# EAGLE schematic otterley_B_v1_2 (EAGLE 9.6.2)

## Sheet 1 of 6: Power
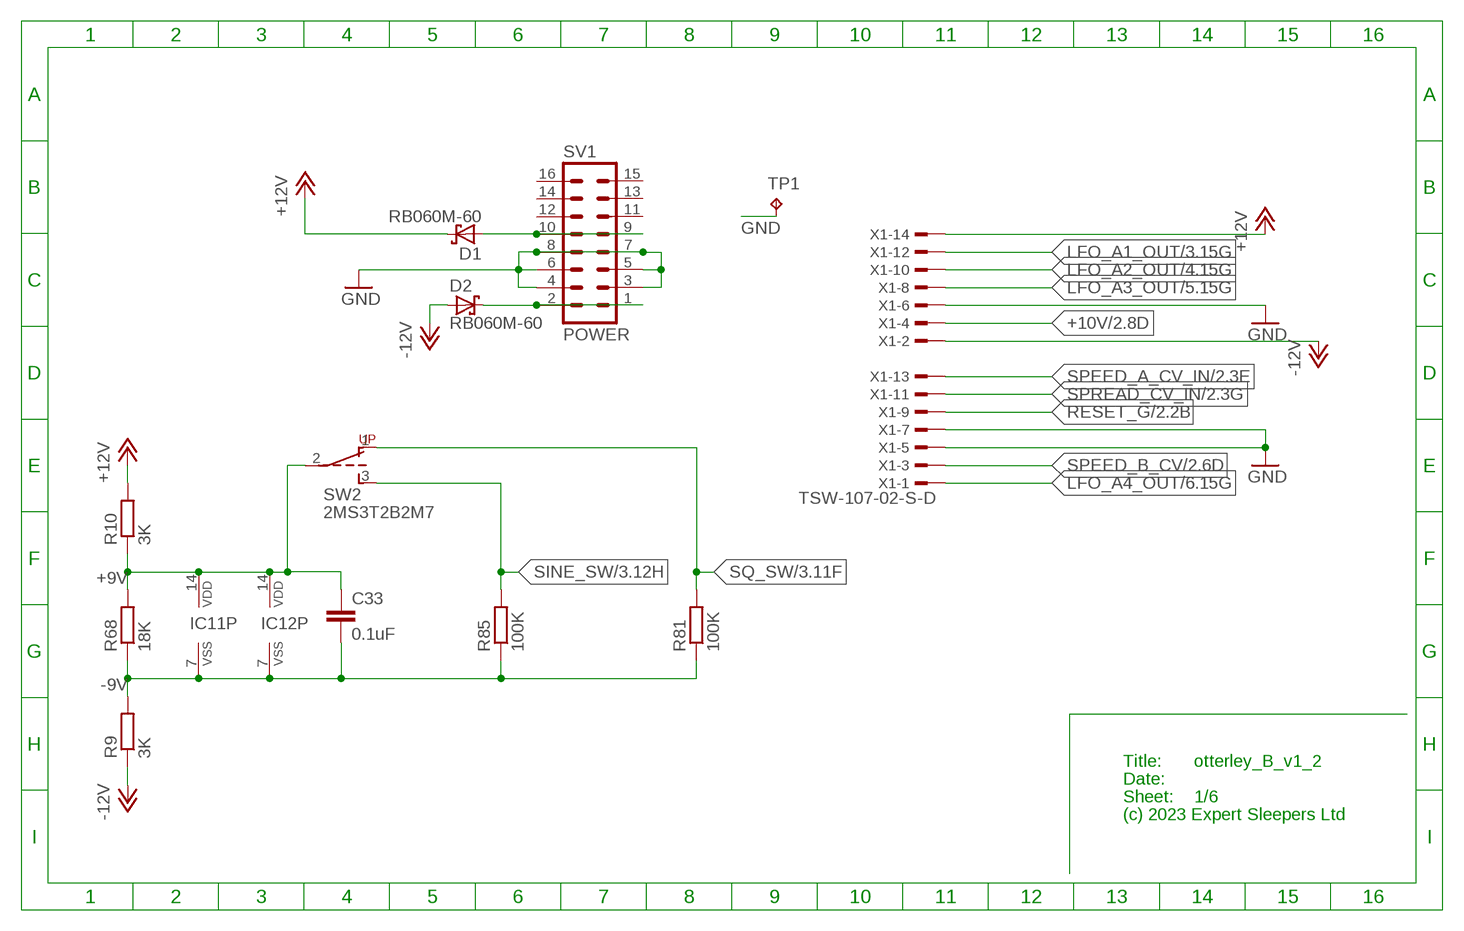
[diagram p0: schematic, sheet 1]

### Parts
C33  0.1uF  C-EUC0402  [C0402]
D1  RB060M-60  [SOD123FL]
D2  RB060M-60  [SOD123FL]
IC11  CD4066BPW  [PW_R-PDSO-G14]
IC12  CD4066BPW  [PW_R-PDSO-G14]
R9  3K  R-EU_R0603  [R0603]
R10  3K  R-EU_R0603  [R0603]
R68  18K  R-EU_R0603  [R0603]
R81  100K  R-EU_R0603  [R0603]
R85  100K  R-EU_R0603  [R0603]
SV1  POWER  ML16  [ML16]
SW2  2MS3T2B2M7  [2MS1T2B2M7RE]
TP1  RA2  TPPAD1-13  [P1-13]
X1  TSW-107-02-S-D  [TSW-107-02-S-D]

### Nets
+9V: C33.1 IC11.14(P:VDD) IC12.14(P:VDD) R10.1 R68.2 SW2.2(PR)
+10V: X1.4 ; also sheet 2,3,4,5,6
+12V: D1.C R10.2 X1.14 ; also sheet 2,3,4,5,6
-9V: C33.2 IC11.7(P:VSS) IC12.7(P:VSS) R9.2 R68.1 R81.1 R85.1
-12V: D2.A R9.1 X1.2 ; also sheet 2,3,4,5,6
GND [power]: SV1.3 SV1.4 SV1.5 SV1.6 SV1.7 SV1.8 TP1.TP X1.5 X1.6 X1.7 ; also sheet 2,3,4,5,6
LFO_A1_OUT: X1.12 ; also sheet 3
LFO_A2_OUT: X1.10 ; also sheet 4
LFO_A3_OUT: X1.8 ; also sheet 5
LFO_A4_OUT: X1.1 ; also sheet 6
N$1: D2.C SV1.1 SV1.2
N$15: D1.A SV1.9 SV1.10
RESET_G: X1.9 ; also sheet 2,3,4,5,6
SINE_SW: R85.2 SW2.3(RD) ; also sheet 3,4,5,6
SPEED_A_CV_IN: X1.13 ; also sheet 2
SPEED_B_CV: X1.3 ; also sheet 2
SPREAD_CV_IN: X1.11 ; also sheet 2
SQ_SW: R81.2 SW2.1(RU) ; also sheet 3,4,5,6
Unconnected: SV1.11 SV1.12 SV1.13 SV1.14 SV1.15 SV1.16

### Notes on the sheet
- Title:
- Date:
- Sheet:
- (c) 2023 Expert Sleepers Ltd

## Sheet 2 of 6: Controls
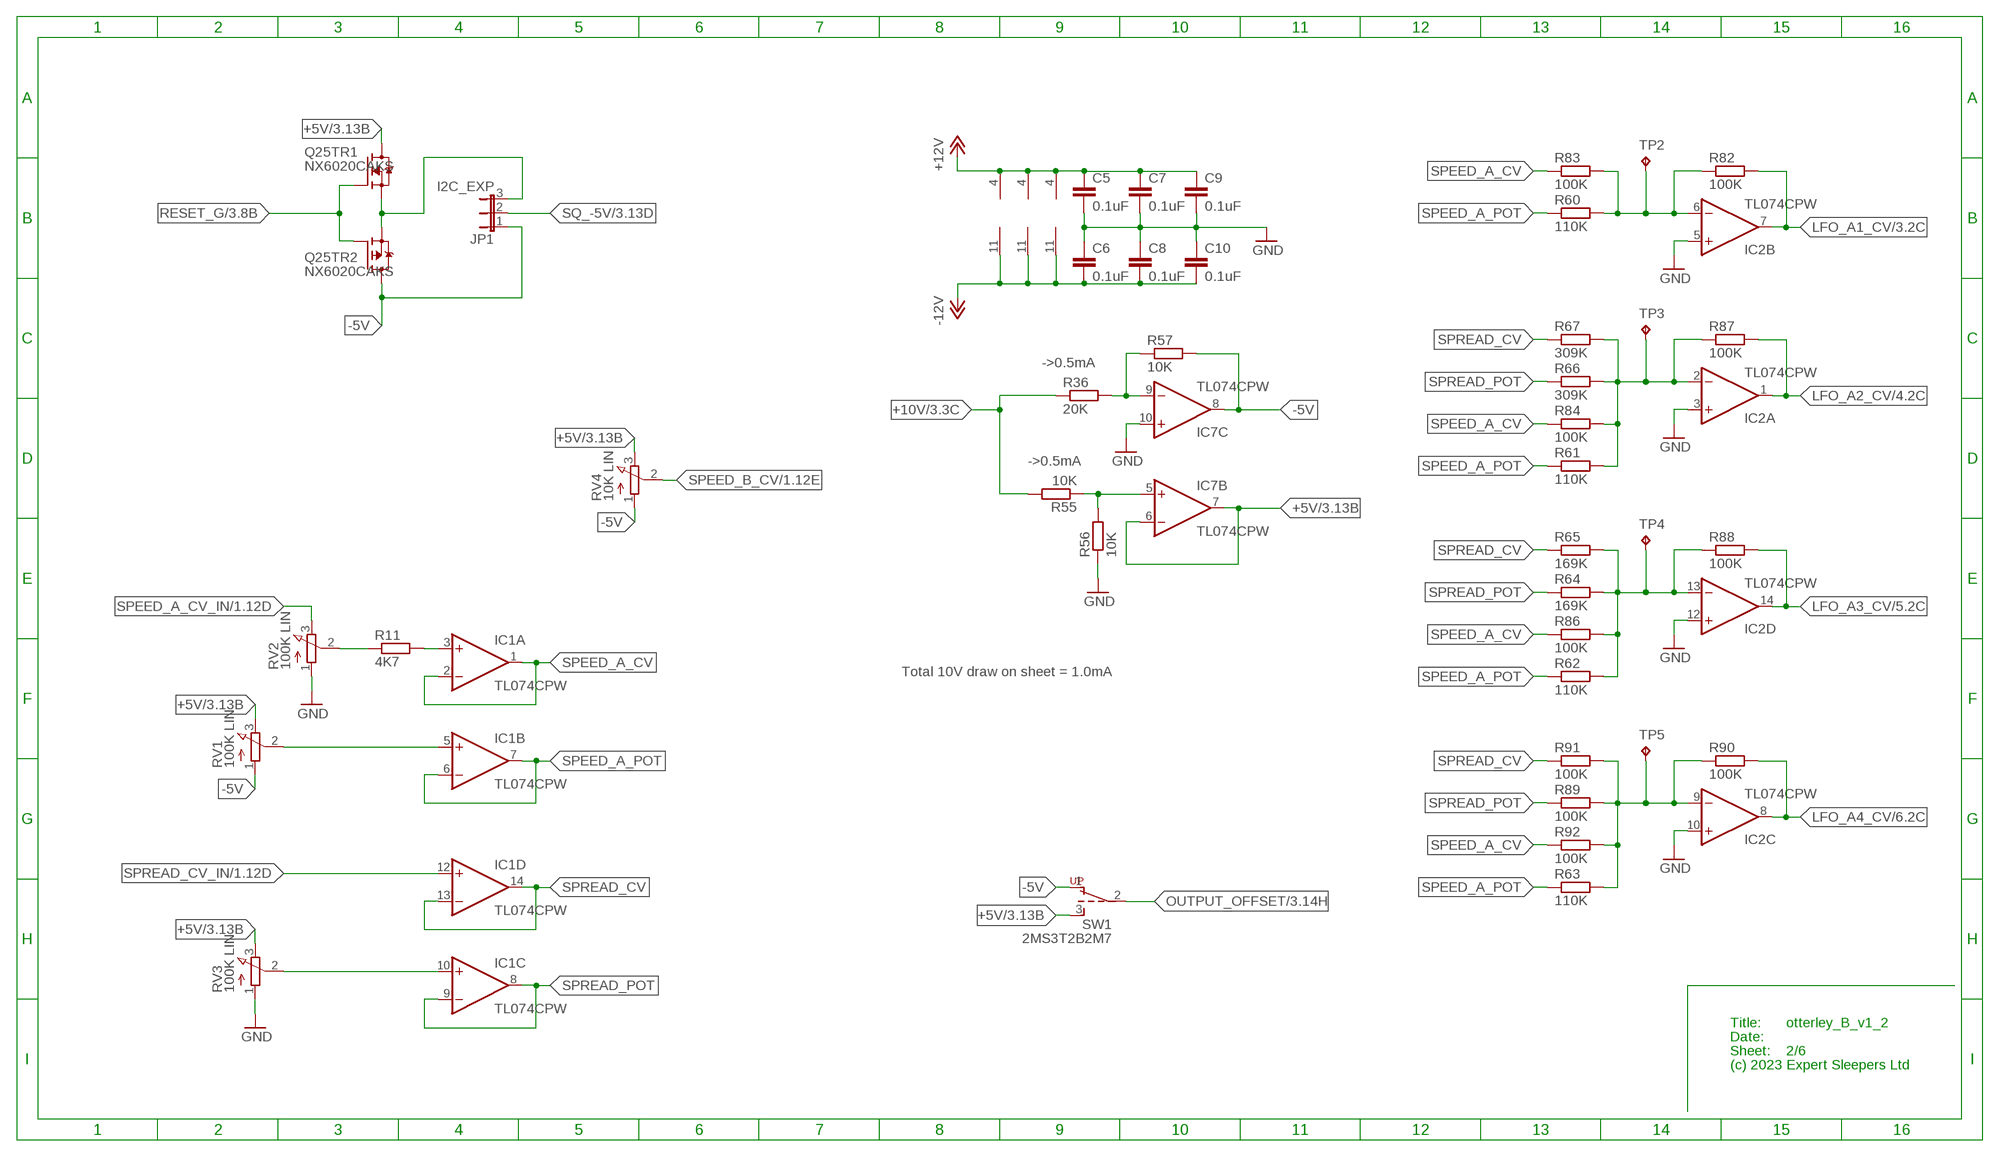
[diagram p1: schematic, sheet 2]

### Parts
C5  0.1uF  C-EUC0402  [C0402]
C6  0.1uF  C-EUC0402  [C0402]
C7  0.1uF  C-EUC0402  [C0402]
C8  0.1uF  C-EUC0402  [C0402]
C9  0.1uF  C-EUC0402  [C0402]
C10  0.1uF  C-EUC0402  [C0402]
IC1  TL074CPW  TL074PW  [PW_R-PDSO-G14]
IC2  TL074CPW  TL074PW  [PW_R-PDSO-G14]
IC7  TL074CPW  TL074PW  [PW_R-PDSO-G14]
JP1  I2C_EXP  JP2E  [JP2]
Q25  NX6020CAKS  [SOT363]
R11  4K7  R-EU_R0603  [R0603]
R36  20K  R-EU_R0603  [R0603]
R55  10K  R-EU_R0603  [R0603]
R56  10K  R-EU_R0603  [R0603]
R57  10K  R-EU_R0603  [R0603]
R60  110K  R-EU_R0603  [R0603]
R61  110K  R-EU_R0603  [R0603]
R62  110K  R-EU_R0603  [R0603]
R63  110K  R-EU_R0603  [R0603]
R64  169K  R-EU_R0603  [R0603]
R65  169K  R-EU_R0603  [R0603]
R66  309K  R-EU_R0603  [R0603]
R67  309K  R-EU_R0603  [R0603]
R82  100K  R-EU_R0603  [R0603]
R83  100K  R-EU_R0603  [R0603]
R84  100K  R-EU_R0603  [R0603]
R86  100K  R-EU_R0603  [R0603]
R87  100K  R-EU_R0603  [R0603]
R88  100K  R-EU_R0603  [R0603]
R89  100K  R-EU_R0603  [R0603]
R90  100K  R-EU_R0603  [R0603]
R91  100K  R-EU_R0603  [R0603]
R92  100K  R-EU_R0603  [R0603]
RV1  100K LIN  RD1610NOA0X  [RD1610NOA0X]
RV2  100K LIN  RD1610NOA0X  [RD1610NOA0X]
RV3  100K LIN  RD1610NOA0X  [RD1610NOA0X]
RV4  10K LIN  RD1610NOA0X  [RD1610NOA0X]
SW1  2MS3T2B2M7  [2MS1T2B2M7RE]
TP2  RA2  TPPAD1-13  [P1-13]
TP3  RA2  TPPAD1-13  [P1-13]
TP4  RA2  TPPAD1-13  [P1-13]
TP5  RA2  TPPAD1-13  [P1-13]

### Nets
+5V: IC7.6(B:-IN) IC7.7(B:OUT) Q25.6(TR1:D) RV1.3(E) RV3.3(E) RV4.3(E) SW1.3(RD) ; also sheet 3,4,5,6
+10V: R36.1 R55.2 ; also sheet 1,3,4,5,6
+12V: C5.1 C7.1 C9.1 IC1.4(P:V+) IC2.4(P:V+) IC7.4(P:V+) ; also sheet 1,3,4,5,6
-5V [power]: IC7.8(C:OUT) JP1.1 Q25.3(TR2:D) R57.2 RV1.1(A) RV4.1(A) SW1.1(RU)
-12V: C6.2 C8.2 C10.2 IC1.11(P:V-) IC2.11(P:V-) IC7.11(P:V-) ; also sheet 1,3,4,5,6
GND [power]: C5.2 C6.1 C7.2 C8.1 C9.2 C10.1 IC2.3(A:+IN) IC2.5(B:+IN) IC2.10(C:+IN) IC2.12(D:+IN) IC7.10(C:+IN) R56.1 RV2.1(A) RV3.1(A) ; also sheet 1,3,4,5,6
LFO_A1_CV: IC2.7(B:OUT) R82.2 ; also sheet 3
LFO_A2_CV: IC2.1(A:OUT) R87.2 ; also sheet 4
LFO_A3_CV: IC2.14(D:OUT) R88.2 ; also sheet 5
LFO_A4_CV: IC2.8(C:OUT) R90.2 ; also sheet 6
N$6: JP1.3 Q25.1(TR1:S) Q25.4(TR2:S)
N$7: IC1.5(B:+IN) RV1.2(S)
N$9: R11.1 RV2.2(S)
N$10: IC7.5(B:+IN) R55.1 R56.2
N$13: IC7.9(C:-IN) R36.2 R57.1
N$31: IC2.2(A:-IN) R61.2 R66.2 R67.2 R84.2 R87.1 TP3.TP
N$32: IC1.3(A:+IN) R11.2
N$52: IC2.6(B:-IN) R60.2 R82.1 R83.2 TP2.TP
N$57: IC1.10(C:+IN) RV3.2(S)
N$90: IC2.13(D:-IN) R62.2 R64.2 R65.2 R86.2 R88.1 TP4.TP
N$91: IC2.9(C:-IN) R63.2 R89.2 R90.1 R91.2 R92.2 TP5.TP
OUTPUT_OFFSET: SW1.2(PR) ; also sheet 3,4,5,6
RESET_G: Q25.2(TR1:G) Q25.5(TR2:G) ; also sheet 1,3,4,5,6
SPEED_A_CV: IC1.1(A:OUT) IC1.2(A:-IN) R83.1 R84.1 R86.1 R92.1
SPEED_A_CV_IN: RV2.3(E) ; also sheet 1
SPEED_A_POT: IC1.6(B:-IN) IC1.7(B:OUT) R60.1 R61.1 R62.1 R63.1
SPEED_B_CV: RV4.2(S) ; also sheet 1
SPREAD_CV: IC1.13(D:-IN) IC1.14(D:OUT) R65.1 R67.1 R91.1
SPREAD_CV_IN: IC1.12(D:+IN) ; also sheet 1
SPREAD_POT: IC1.8(C:OUT) IC1.9(C:-IN) R64.1 R66.1 R89.1
SQ_-5V: JP1.2 ; also sheet 3,4,5,6

### Notes on the sheet
- ->0.5mA
- ->0.5mA
- Total 10V draw on sheet = 1.0mA
- Title:
- Date:
- Sheet:
- (c) 2023 Expert Sleepers Ltd

## Sheet 3 of 6: LFO A1
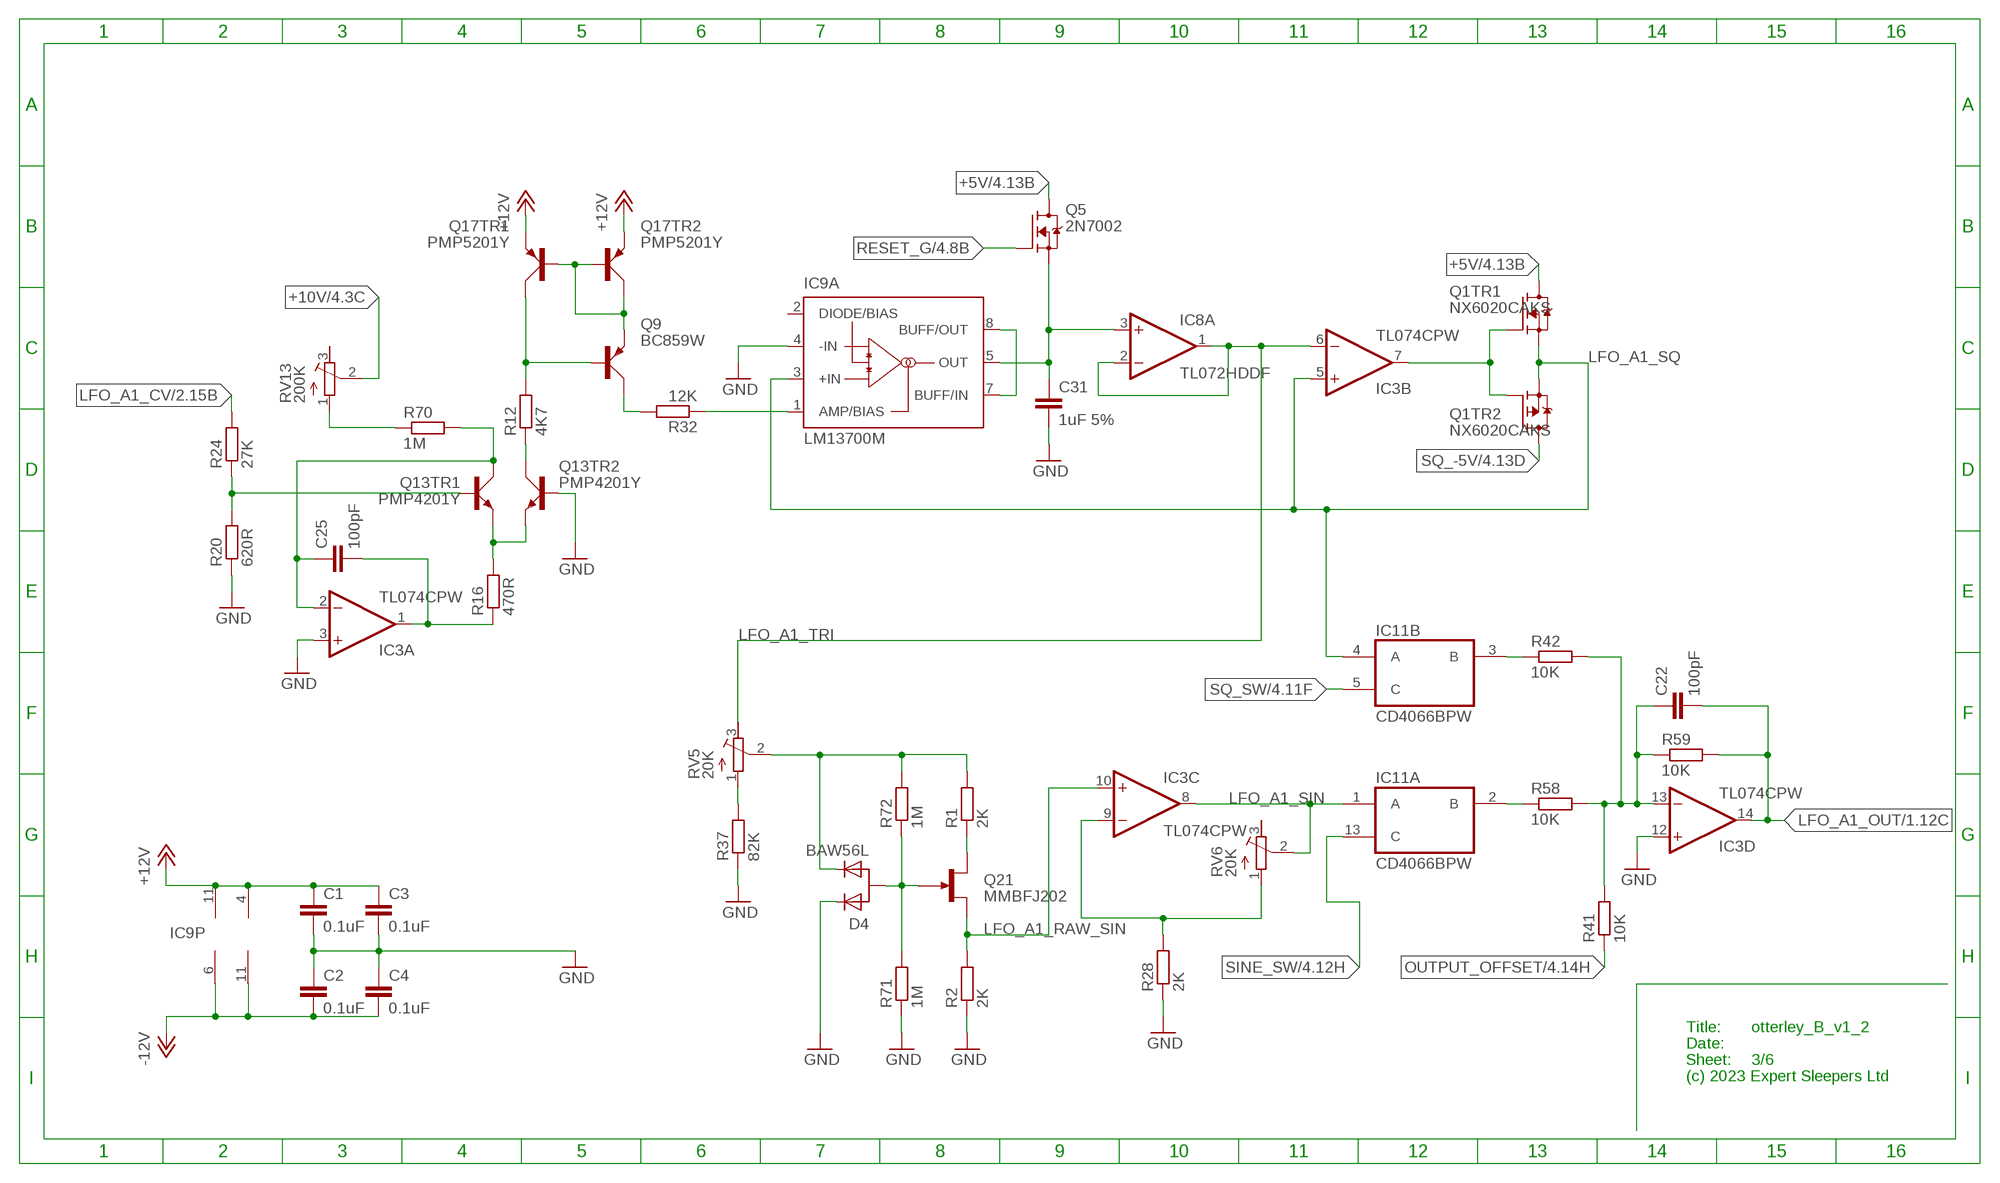
[diagram p2: schematic, sheet 3]

### Parts
C1  0.1uF  C-EUC0402  [C0402]
C2  0.1uF  C-EUC0402  [C0402]
C3  0.1uF  C-EUC0402  [C0402]
C4  0.1uF  C-EUC0402  [C0402]
C22  100pF  C-EUC0603  [C0603]
C25  100pF  C-EUC0603  [C0603]
C31  1uF 5%  C-EUC0805  [C0805]
D4  BAW56L  [SOT-23]
IC3  TL074CPW  TL074PW  [PW_R-PDSO-G14]
IC8  TL072HDDF  [DDF0008A]
IC9  LM13700M  [SO16]
Q1  NX6020CAKS  [SOT363]
Q5  2N7002  [SOT23]
Q9  BC859W  [SOT323]
Q13  PMP4201Y  [SOT65P210X110-6N]
Q17  PMP5201Y  [SOT65P210X110-6N]
Q21  MMBFJ202  MMBFJ3  [SOT23]
R1  2K  R-EU_R0603  [R0603]
R2  2K  R-EU_R0603  [R0603]
R12  4K7  R-EU_R0603  [R0603]
R16  470R  R-EU_R0603  [R0603]
R20  620R  R-EU_R0603  [R0603]
R24  27K  R-EU_R0603  [R0603]
R28  2K  R-EU_R0603  [R0603]
R32  12K  R-EU_R0603  [R0603]
R37  82K  R-EU_R0603  [R0603]
R41  10K  R-EU_R0603  [R0603]
R42  10K  R-EU_R0603  [R0603]
R58  10K  R-EU_R0603  [R0603]
R59  10K  R-EU_R0603  [R0603]
R70  1M  R-EU_R0603  [R0603]
R71  1M  R-EU_R0603  [R0603]
R72  1M  R-EU_R0603  [R0603]
RV5  20K  TC33X  [TC33X]
RV6  20K  TC33X  [TC33X]
RV13  200K  TC33X  [TC33X]

### Nets
+5V: Q1.6(TR1:D) Q5.3(D) ; also sheet 2,4,5,6
+10V: RV13.2(S) ; also sheet 1,2,4,5,6
+12V: C1.1 C3.1 IC3.4(P:V+) IC9.11(P:V+) Q17.4(TR2:E) Q17.5(TR1:E) ; also sheet 1,2,4,5,6
-12V: C2.2 C4.2 IC3.11(P:V-) IC9.6(P:V-) ; also sheet 1,2,4,5,6
GND [power]: C1.2 C2.1 C3.2 C4.1 C31.2 D4.1(C1) IC3.3(A:+IN) IC3.12(D:+IN) IC9.4(A:-IN) Q13.2(TR2:B) R2.1 R20.1 R28.1 R37.1 R71.1 ; also sheet 1,2,4,5,6
LFO_A1_CV: R24.2 ; also sheet 2
LFO_A1_OUT: C22.2 IC3.14(D:OUT) R59.2 ; also sheet 1
LFO_A1_RAW_SIN: IC3.10(C:+IN) Q21.2(S) R2.2
LFO_A1_SIN: IC3.8(C:OUT) IC11.1(A:A) RV6.2(S)
LFO_A1_SQ: IC3.5(B:+IN) IC9.3(A:+IN) IC11.4(B:A) Q1.1(TR1:S) Q1.4(TR2:S)
LFO_A1_TRI: IC3.6(B:-IN) IC8.1(A:OUT) IC8.2(A:-IN) RV5.3(E)
N$3: IC9.7(A:BUFF/IN) IC9.8(A:BUFF/OUT)
N$5: IC11.3(B:B) R42.1
N$14: C31.1 IC8.3(A:+IN) IC9.5(A:OUT) Q5.2(S)
N$24: IC9.1(A:AMP/BIAS) R32.1
N$26: C25.1 IC3.2(A:-IN) Q13.6(TR1:C) R70.2
N$27: C25.2 IC3.1(A:OUT) R16.1
N$28: Q13.4(TR2:E) Q13.5(TR1:E) R16.2
N$33: Q9.3(C) R32.2
N$34: Q13.3(TR2:C) R12.1
N$35: Q9.1(B) Q17.6(TR1:C) R12.2
N$36: Q9.2(E) Q17.1(TR1:B) Q17.2(TR2:B) Q17.3(TR2:C)
N$37: IC3.9(C:-IN) R28.2 RV6.1(A)
N$39: R37.2 RV5.1(A)
N$40: D4.2(C2) R1.2 R72.2 RV5.2(S)
N$42: D4.3(A) Q21.3(G) R71.2 R72.1
N$43: C22.1 IC3.13(D:-IN) R41.2 R42.2 R58.2 R59.1
N$44: Q21.1(D) R1.1
N$48: IC11.2(A:B) R58.1
N$49: R70.1 RV13.1(A)
N$51: Q13.1(TR1:B) R20.2 R24.1
N$53: IC3.7(B:OUT) Q1.2(TR1:G) Q1.5(TR2:G)
OUTPUT_OFFSET: R41.1 ; also sheet 2,4,5,6
RESET_G: Q5.1(G) ; also sheet 1,2,4,5,6
SINE_SW: IC11.13(A:C) ; also sheet 1,4,5,6
SQ_-5V: Q1.3(TR2:D) ; also sheet 2,4,5,6
SQ_SW: IC11.5(B:C) ; also sheet 1,4,5,6
Unconnected: IC9.2(A:DIODE/BIAS) RV6.3(E) RV13.3(E)

### Notes on the sheet
- Title:
- Date:
- Sheet:
- (c) 2023 Expert Sleepers Ltd

## Sheet 4 of 6: LFO A2
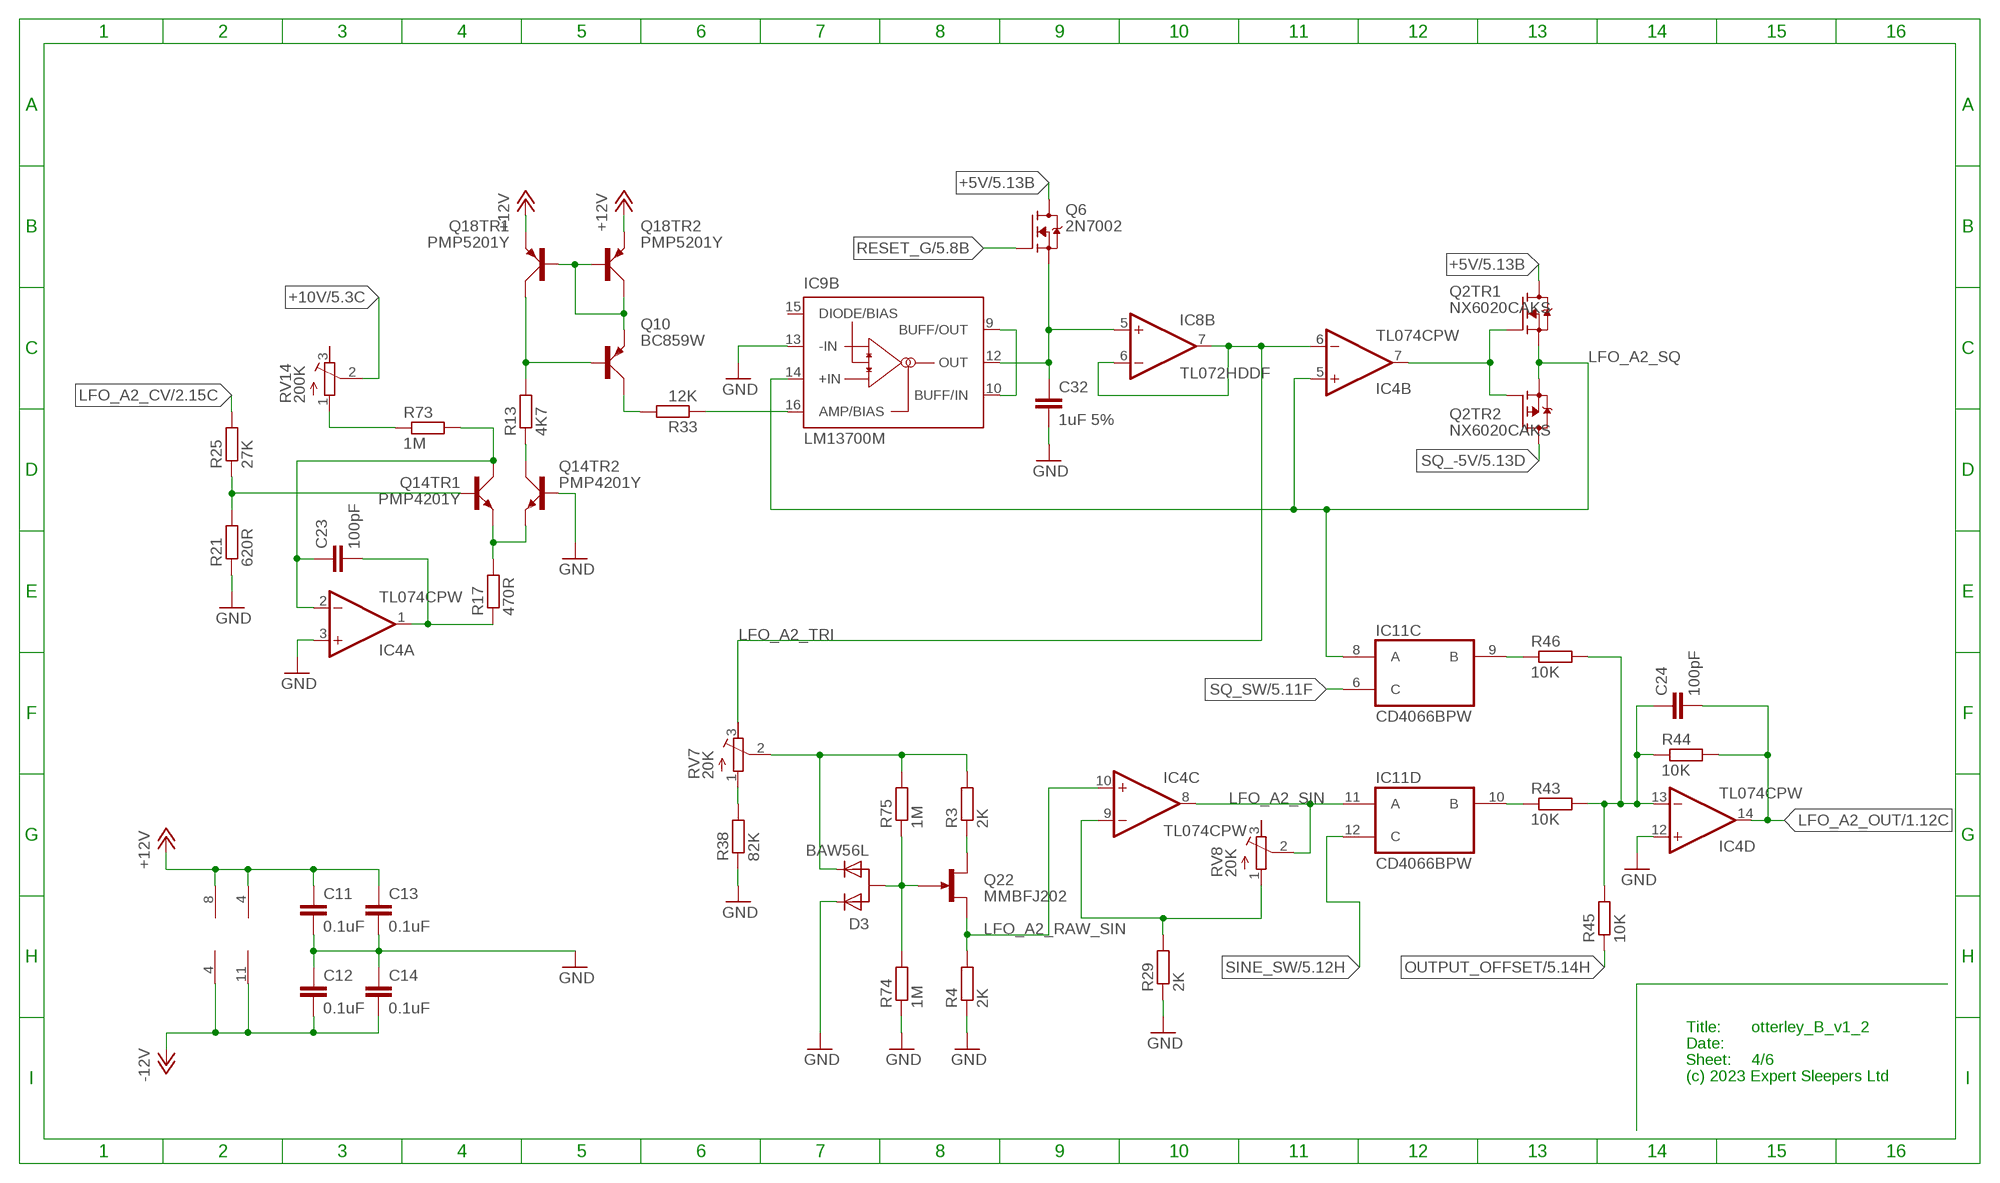
[diagram p3: schematic, sheet 4]

### Parts
C11  0.1uF  C-EUC0402  [C0402]
C12  0.1uF  C-EUC0402  [C0402]
C13  0.1uF  C-EUC0402  [C0402]
C14  0.1uF  C-EUC0402  [C0402]
C23  100pF  C-EUC0603  [C0603]
C24  100pF  C-EUC0603  [C0603]
C32  1uF 5%  C-EUC0805  [C0805]
D3  BAW56L  [SOT-23]
IC4  TL074CPW  TL074PW  [PW_R-PDSO-G14]
Q2  NX6020CAKS  [SOT363]
Q6  2N7002  [SOT23]
Q10  BC859W  [SOT323]
Q14  PMP4201Y  [SOT65P210X110-6N]
Q18  PMP5201Y  [SOT65P210X110-6N]
Q22  MMBFJ202  MMBFJ3  [SOT23]
R3  2K  R-EU_R0603  [R0603]
R4  2K  R-EU_R0603  [R0603]
R13  4K7  R-EU_R0603  [R0603]
R17  470R  R-EU_R0603  [R0603]
R21  620R  R-EU_R0603  [R0603]
R25  27K  R-EU_R0603  [R0603]
R29  2K  R-EU_R0603  [R0603]
R33  12K  R-EU_R0603  [R0603]
R38  82K  R-EU_R0603  [R0603]
R43  10K  R-EU_R0603  [R0603]
R44  10K  R-EU_R0603  [R0603]
R45  10K  R-EU_R0603  [R0603]
R46  10K  R-EU_R0603  [R0603]
R73  1M  R-EU_R0603  [R0603]
R74  1M  R-EU_R0603  [R0603]
R75  1M  R-EU_R0603  [R0603]
RV7  20K  TC33X  [TC33X]
RV8  20K  TC33X  [TC33X]
RV14  200K  TC33X  [TC33X]

### Nets
+5V: Q2.6(TR1:D) Q6.3(D) ; also sheet 2,3,5,6
+10V: RV14.2(S) ; also sheet 1,2,3,5,6
+12V: C11.1 C13.1 IC4.4(P:V+) IC8.8(P:V+) Q18.4(TR2:E) Q18.5(TR1:E) ; also sheet 1,2,3,5,6
-12V: C12.2 C14.2 IC4.11(P:V-) IC8.4(P:V-) ; also sheet 1,2,3,5,6
GND [power]: C11.2 C12.1 C13.2 C14.1 C32.2 D3.1(C1) IC4.3(A:+IN) IC4.12(D:+IN) IC9.13(B:-IN) Q14.2(TR2:B) R4.1 R21.1 R29.1 R38.1 R74.1 ; also sheet 1,2,3,5,6
LFO_A2_CV: R25.2 ; also sheet 2
LFO_A2_OUT: C24.2 IC4.14(D:OUT) R44.2 ; also sheet 1
LFO_A2_RAW_SIN: IC4.10(C:+IN) Q22.2(S) R4.2
LFO_A2_SIN: IC4.8(C:OUT) IC11.11(D:A) RV8.2(S)
LFO_A2_SQ: IC4.5(B:+IN) IC9.14(B:+IN) IC11.8(C:A) Q2.1(TR1:S) Q2.4(TR2:S)
LFO_A2_TRI: IC4.6(B:-IN) IC8.6(B:-IN) IC8.7(B:OUT) RV7.3(E)
N$8: IC11.9(C:B) R46.1
N$11: IC9.9(B:BUFF/OUT) IC9.10(B:BUFF/IN)
N$75: C32.1 IC8.5(B:+IN) IC9.12(B:OUT) Q6.2(S)
N$93: IC9.16(B:AMP/BIAS) R33.1
N$94: C23.1 IC4.2(A:-IN) Q14.6(TR1:C) R73.2
N$95: C23.2 IC4.1(A:OUT) R17.1
N$96: Q14.4(TR2:E) Q14.5(TR1:E) R17.2
N$97: Q10.3(C) R33.2
N$98: Q10.1(B) Q18.6(TR1:C) R13.2
N$99: Q10.2(E) Q18.1(TR1:B) Q18.2(TR2:B) Q18.3(TR2:C)
N$100: Q14.3(TR2:C) R13.1
N$101: R38.2 RV7.1(A)
N$102: D3.2(C2) R3.2 R75.2 RV7.2(S)
N$103: D3.3(A) Q22.3(G) R74.2 R75.1
N$104: Q22.1(D) R3.1
N$105: IC4.9(C:-IN) R29.2 RV8.1(A)
N$107: C24.1 IC4.13(D:-IN) R43.2 R44.1 R45.2 R46.2
N$109: IC4.7(B:OUT) Q2.2(TR1:G) Q2.5(TR2:G)
N$110: IC11.10(D:B) R43.1
N$111: R73.1 RV14.1(A)
N$112: Q14.1(TR1:B) R21.2 R25.1
OUTPUT_OFFSET: R45.1 ; also sheet 2,3,5,6
RESET_G: Q6.1(G) ; also sheet 1,2,3,5,6
SINE_SW: IC11.12(D:C) ; also sheet 1,3,5,6
SQ_-5V: Q2.3(TR2:D) ; also sheet 2,3,5,6
SQ_SW: IC11.6(C:C) ; also sheet 1,3,5,6
Unconnected: IC9.15(B:DIODE/BIAS) RV8.3(E) RV14.3(E)

### Notes on the sheet
- Title:
- Date:
- Sheet:
- (c) 2023 Expert Sleepers Ltd

## Sheet 5 of 6: LFO A3
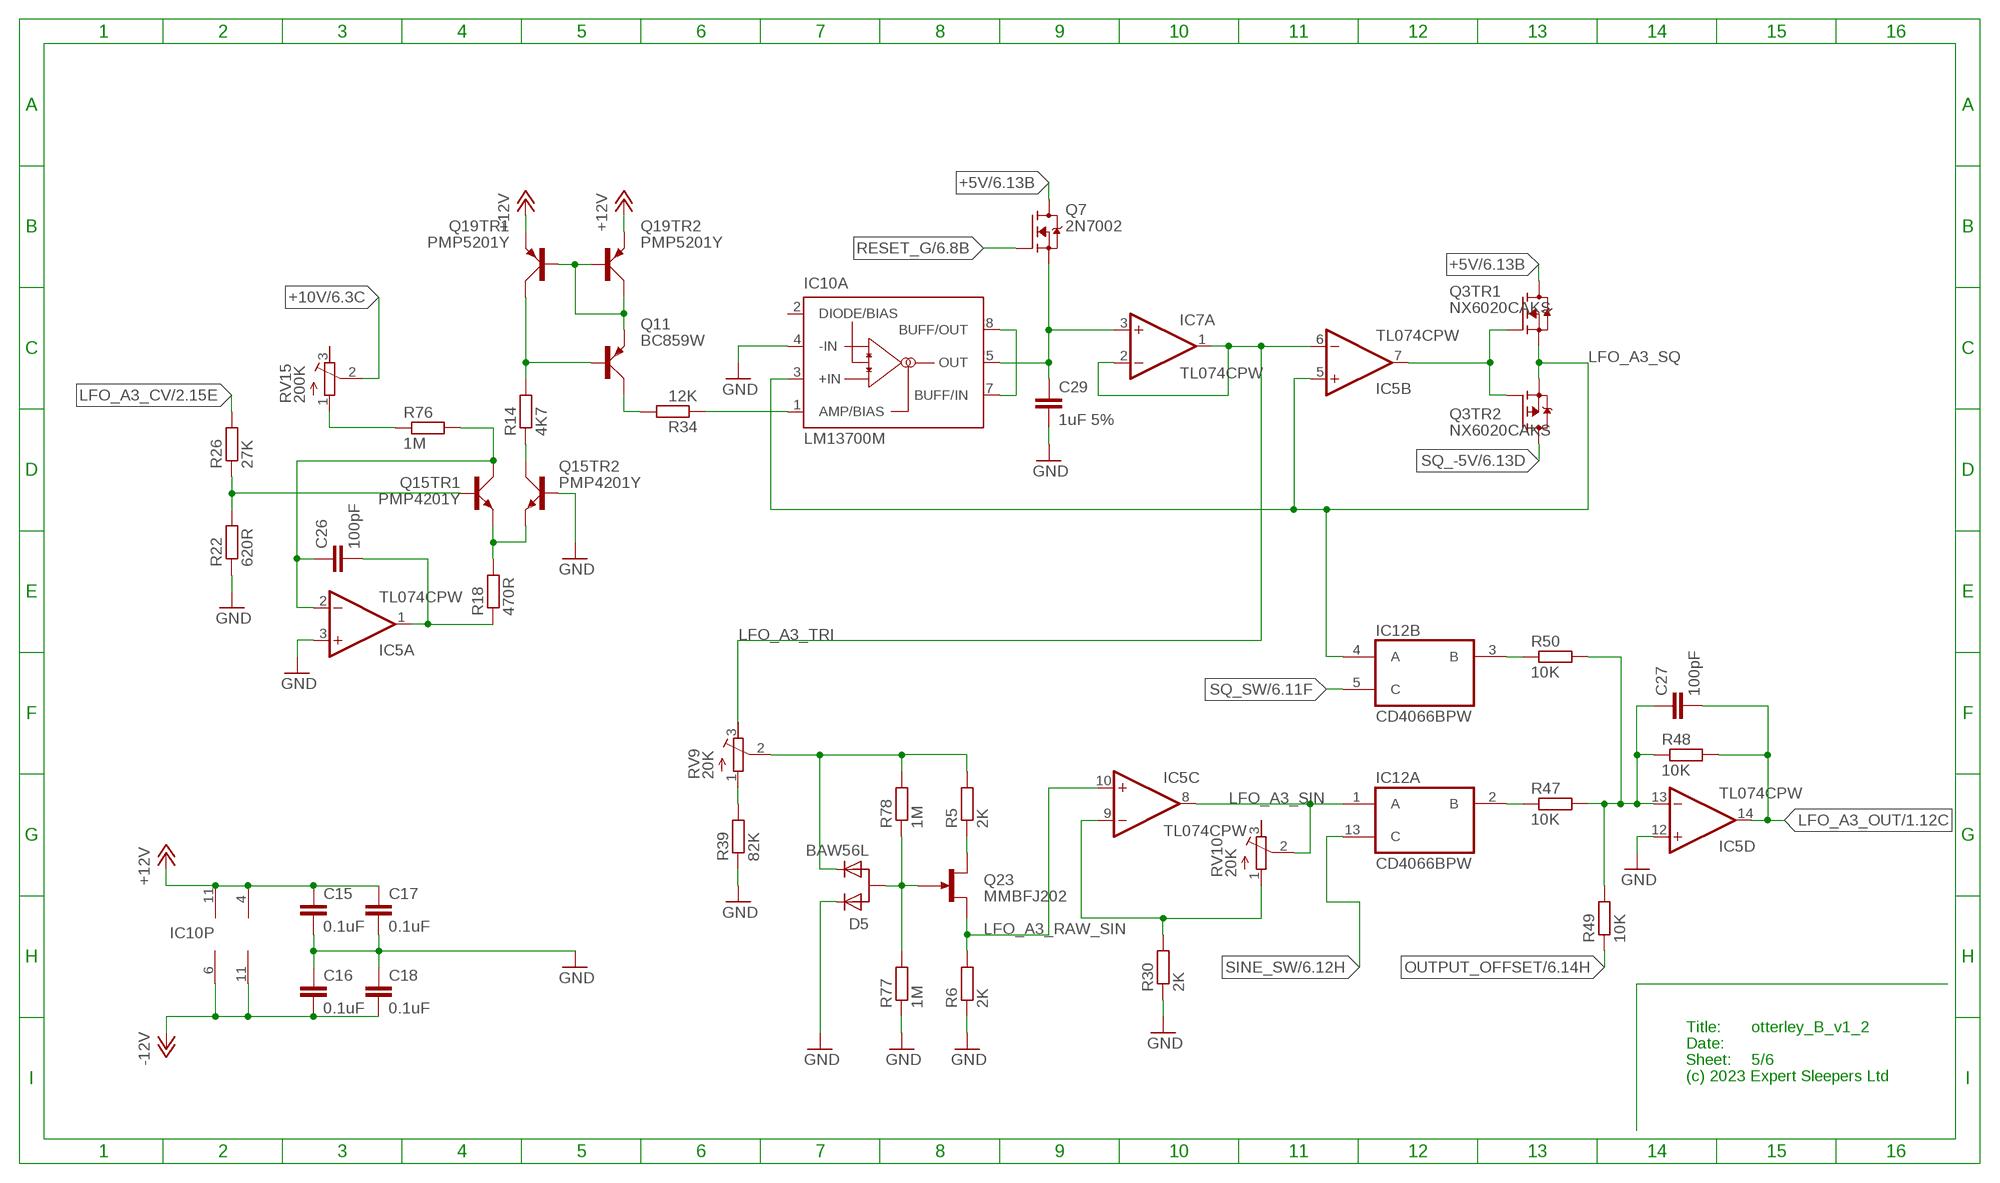
[diagram p4: schematic, sheet 5]

### Parts
C15  0.1uF  C-EUC0402  [C0402]
C16  0.1uF  C-EUC0402  [C0402]
C17  0.1uF  C-EUC0402  [C0402]
C18  0.1uF  C-EUC0402  [C0402]
C26  100pF  C-EUC0603  [C0603]
C27  100pF  C-EUC0603  [C0603]
C29  1uF 5%  C-EUC0805  [C0805]
D5  BAW56L  [SOT-23]
IC5  TL074CPW  TL074PW  [PW_R-PDSO-G14]
IC10  LM13700M  [SO16]
Q3  NX6020CAKS  [SOT363]
Q7  2N7002  [SOT23]
Q11  BC859W  [SOT323]
Q15  PMP4201Y  [SOT65P210X110-6N]
Q19  PMP5201Y  [SOT65P210X110-6N]
Q23  MMBFJ202  MMBFJ3  [SOT23]
R5  2K  R-EU_R0603  [R0603]
R6  2K  R-EU_R0603  [R0603]
R14  4K7  R-EU_R0603  [R0603]
R18  470R  R-EU_R0603  [R0603]
R22  620R  R-EU_R0603  [R0603]
R26  27K  R-EU_R0603  [R0603]
R30  2K  R-EU_R0603  [R0603]
R34  12K  R-EU_R0603  [R0603]
R39  82K  R-EU_R0603  [R0603]
R47  10K  R-EU_R0603  [R0603]
R48  10K  R-EU_R0603  [R0603]
R49  10K  R-EU_R0603  [R0603]
R50  10K  R-EU_R0603  [R0603]
R76  1M  R-EU_R0603  [R0603]
R77  1M  R-EU_R0603  [R0603]
R78  1M  R-EU_R0603  [R0603]
RV9  20K  TC33X  [TC33X]
RV10  20K  TC33X  [TC33X]
RV15  200K  TC33X  [TC33X]

### Nets
+5V: Q3.6(TR1:D) Q7.3(D) ; also sheet 2,3,4,6
+10V: RV15.2(S) ; also sheet 1,2,3,4,6
+12V: C15.1 C17.1 IC5.4(P:V+) IC10.11(P:V+) Q19.4(TR2:E) Q19.5(TR1:E) ; also sheet 1,2,3,4,6
-12V: C16.2 C18.2 IC5.11(P:V-) IC10.6(P:V-) ; also sheet 1,2,3,4,6
GND [power]: C15.2 C16.1 C17.2 C18.1 C29.2 D5.1(C1) IC5.3(A:+IN) IC5.12(D:+IN) IC10.4(A:-IN) Q15.2(TR2:B) R6.1 R22.1 R30.1 R39.1 R77.1 ; also sheet 1,2,3,4,6
LFO_A3_CV: R26.2 ; also sheet 2
LFO_A3_OUT: C27.2 IC5.14(D:OUT) R48.2 ; also sheet 1
LFO_A3_RAW_SIN: IC5.10(C:+IN) Q23.2(S) R6.2
LFO_A3_SIN: IC5.8(C:OUT) IC12.1(A:A) RV10.2(S)
LFO_A3_SQ: IC5.5(B:+IN) IC10.3(A:+IN) IC12.4(B:A) Q3.1(TR1:S) Q3.4(TR2:S)
LFO_A3_TRI: IC5.6(B:-IN) IC7.1(A:OUT) IC7.2(A:-IN) RV9.3(E)
N$12: IC10.7(A:BUFF/IN) IC10.8(A:BUFF/OUT)
N$17: IC12.3(B:B) R50.1
N$115: C29.1 IC7.3(A:+IN) IC10.5(A:OUT) Q7.2(S)
N$118: IC10.1(A:AMP/BIAS) R34.1
N$119: C26.1 IC5.2(A:-IN) Q15.6(TR1:C) R76.2
N$120: C26.2 IC5.1(A:OUT) R18.1
N$121: Q15.4(TR2:E) Q15.5(TR1:E) R18.2
N$122: Q11.3(C) R34.2
N$123: Q11.1(B) Q19.6(TR1:C) R14.2
N$124: Q11.2(E) Q19.1(TR1:B) Q19.2(TR2:B) Q19.3(TR2:C)
N$125: Q15.3(TR2:C) R14.1
N$126: R39.2 RV9.1(A)
N$127: D5.2(C2) R5.2 R78.2 RV9.2(S)
N$128: D5.3(A) Q23.3(G) R77.2 R78.1
N$129: Q23.1(D) R5.1
N$130: IC5.9(C:-IN) R30.2 RV10.1(A)
N$132: C27.1 IC5.13(D:-IN) R47.2 R48.1 R49.2 R50.2
N$134: IC5.7(B:OUT) Q3.2(TR1:G) Q3.5(TR2:G)
N$135: IC12.2(A:B) R47.1
N$136: R76.1 RV15.1(A)
N$137: Q15.1(TR1:B) R22.2 R26.1
OUTPUT_OFFSET: R49.1 ; also sheet 2,3,4,6
RESET_G: Q7.1(G) ; also sheet 1,2,3,4,6
SINE_SW: IC12.13(A:C) ; also sheet 1,3,4,6
SQ_-5V: Q3.3(TR2:D) ; also sheet 2,3,4,6
SQ_SW: IC12.5(B:C) ; also sheet 1,3,4,6
Unconnected: IC10.2(A:DIODE/BIAS) RV10.3(E) RV15.3(E)

### Notes on the sheet
- Title:
- Date:
- Sheet:
- (c) 2023 Expert Sleepers Ltd

## Sheet 6 of 6: LFO A4
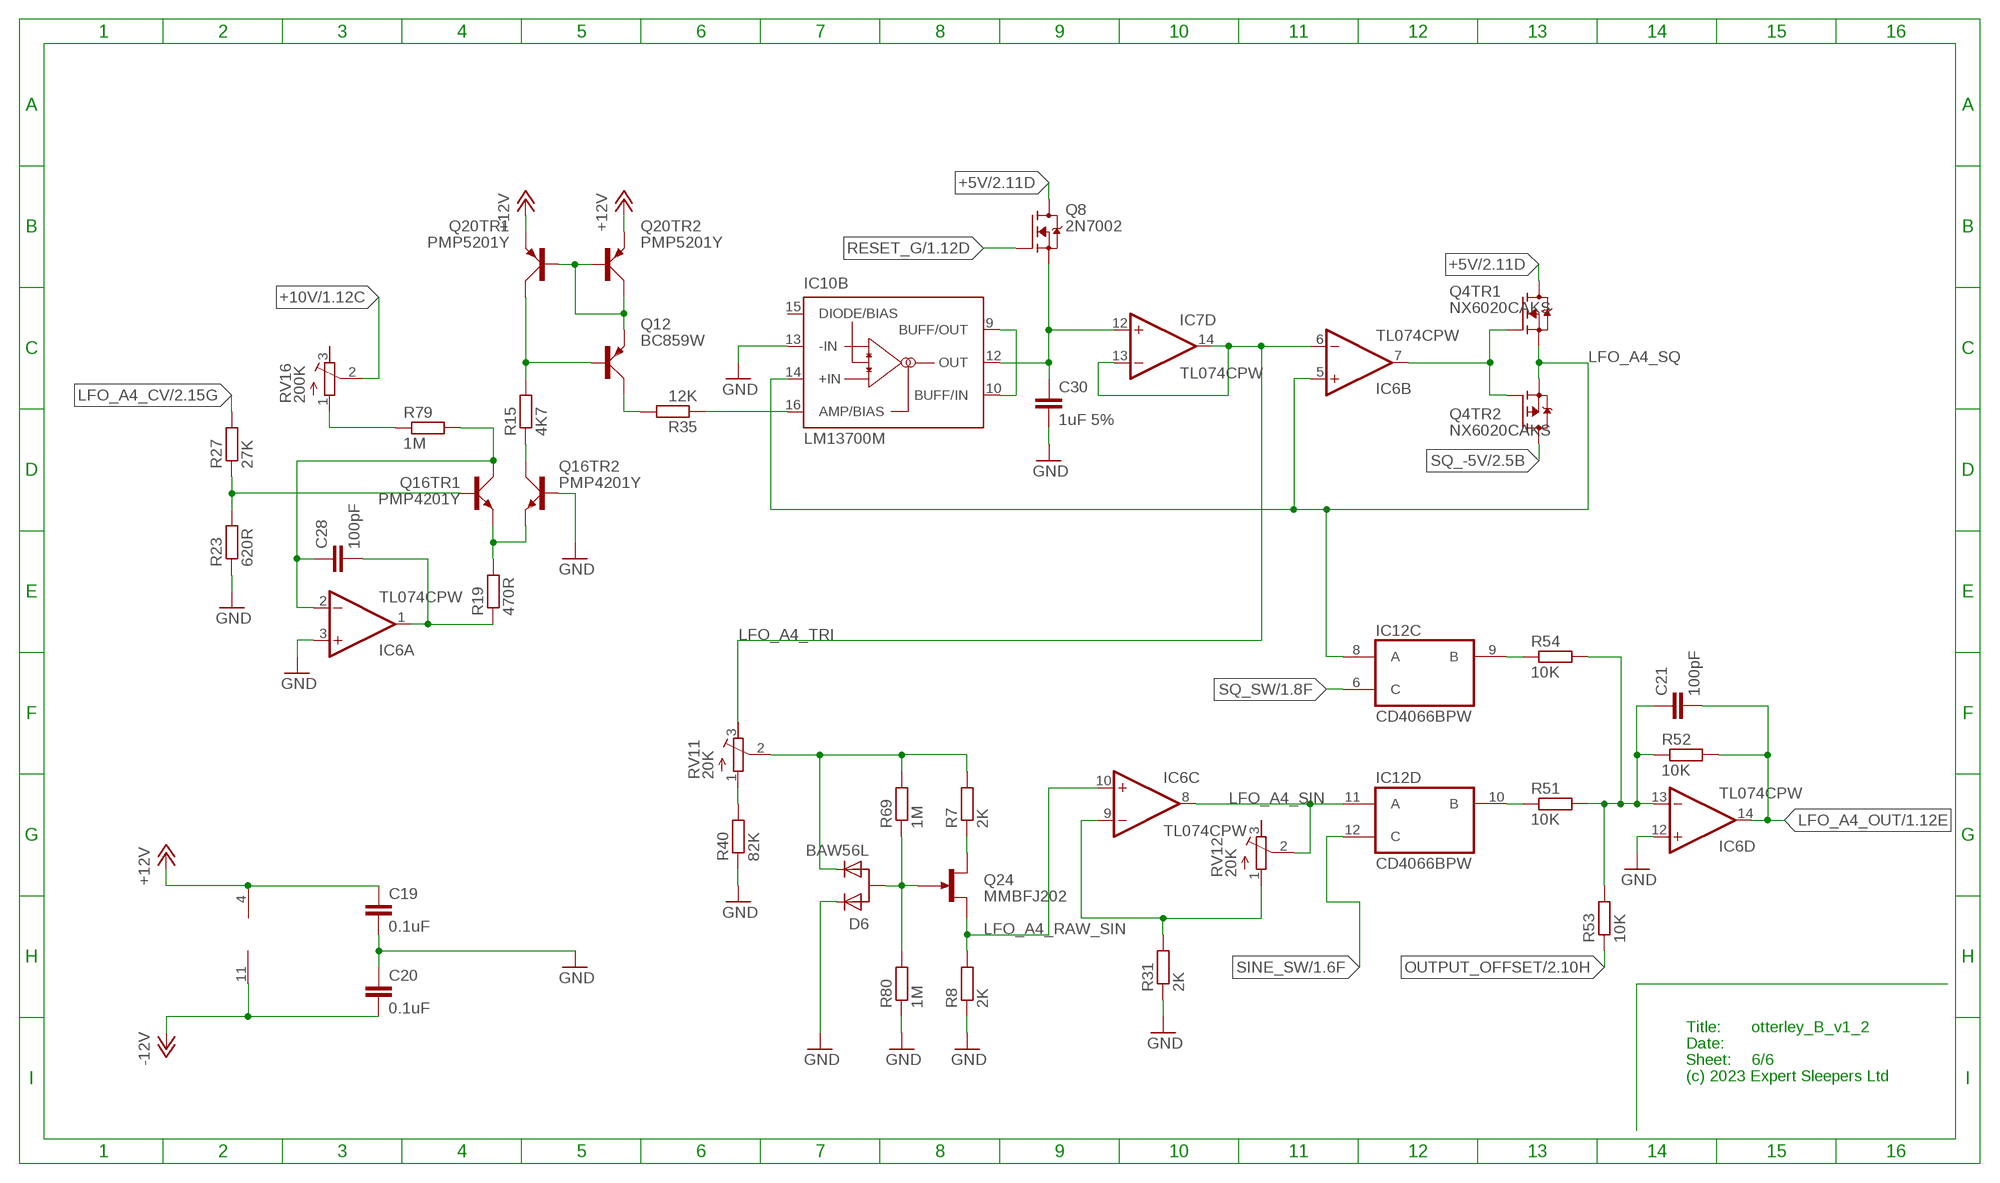
[diagram p5: schematic, sheet 6]

### Parts
C19  0.1uF  C-EUC0402  [C0402]
C20  0.1uF  C-EUC0402  [C0402]
C21  100pF  C-EUC0603  [C0603]
C28  100pF  C-EUC0603  [C0603]
C30  1uF 5%  C-EUC0805  [C0805]
D6  BAW56L  [SOT-23]
IC6  TL074CPW  TL074PW  [PW_R-PDSO-G14]
Q4  NX6020CAKS  [SOT363]
Q8  2N7002  [SOT23]
Q12  BC859W  [SOT323]
Q16  PMP4201Y  [SOT65P210X110-6N]
Q20  PMP5201Y  [SOT65P210X110-6N]
Q24  MMBFJ202  MMBFJ3  [SOT23]
R7  2K  R-EU_R0603  [R0603]
R8  2K  R-EU_R0603  [R0603]
R15  4K7  R-EU_R0603  [R0603]
R19  470R  R-EU_R0603  [R0603]
R23  620R  R-EU_R0603  [R0603]
R27  27K  R-EU_R0603  [R0603]
R31  2K  R-EU_R0603  [R0603]
R35  12K  R-EU_R0603  [R0603]
R40  82K  R-EU_R0603  [R0603]
R51  10K  R-EU_R0603  [R0603]
R52  10K  R-EU_R0603  [R0603]
R53  10K  R-EU_R0603  [R0603]
R54  10K  R-EU_R0603  [R0603]
R69  1M  R-EU_R0603  [R0603]
R79  1M  R-EU_R0603  [R0603]
R80  1M  R-EU_R0603  [R0603]
RV11  20K  TC33X  [TC33X]
RV12  20K  TC33X  [TC33X]
RV16  200K  TC33X  [TC33X]

### Nets
+5V: Q4.6(TR1:D) Q8.3(D) ; also sheet 2,3,4,5
+10V: RV16.2(S) ; also sheet 1,2,3,4,5
+12V: C19.1 IC6.4(P:V+) Q20.4(TR2:E) Q20.5(TR1:E) ; also sheet 1,2,3,4,5
-12V: C20.2 IC6.11(P:V-) ; also sheet 1,2,3,4,5
GND [power]: C19.2 C20.1 C30.2 D6.1(C1) IC6.3(A:+IN) IC6.12(D:+IN) IC10.13(B:-IN) Q16.2(TR2:B) R8.1 R23.1 R31.1 R40.1 R80.1 ; also sheet 1,2,3,4,5
LFO_A4_CV: R27.2 ; also sheet 2
LFO_A4_OUT: C21.2 IC6.14(D:OUT) R52.2 ; also sheet 1
LFO_A4_RAW_SIN: IC6.10(C:+IN) Q24.2(S) R8.2
LFO_A4_SIN: IC6.8(C:OUT) IC12.11(D:A) RV12.2(S)
LFO_A4_SQ: IC6.5(B:+IN) IC10.14(B:+IN) IC12.8(C:A) Q4.1(TR1:S) Q4.4(TR2:S)
LFO_A4_TRI: IC6.6(B:-IN) IC7.13(D:-IN) IC7.14(D:OUT) RV11.3(E)
N$4: IC12.9(C:B) R54.1
N$16: IC10.9(B:BUFF/OUT) IC10.10(B:BUFF/IN)
N$140: C30.1 IC7.12(D:+IN) IC10.12(B:OUT) Q8.2(S)
N$143: IC10.16(B:AMP/BIAS) R35.1
N$144: C28.1 IC6.2(A:-IN) Q16.6(TR1:C) R79.2
N$145: C28.2 IC6.1(A:OUT) R19.1
N$146: Q16.4(TR2:E) Q16.5(TR1:E) R19.2
N$147: Q12.3(C) R35.2
N$148: Q12.1(B) Q20.6(TR1:C) R15.2
N$149: Q12.2(E) Q20.1(TR1:B) Q20.2(TR2:B) Q20.3(TR2:C)
N$150: Q16.3(TR2:C) R15.1
N$151: R40.2 RV11.1(A)
N$152: D6.2(C2) R7.2 R69.2 RV11.2(S)
N$153: D6.3(A) Q24.3(G) R69.1 R80.2
N$154: Q24.1(D) R7.1
N$155: IC6.9(C:-IN) R31.2 RV12.1(A)
N$157: C21.1 IC6.13(D:-IN) R51.2 R52.1 R53.2 R54.2
N$159: IC6.7(B:OUT) Q4.2(TR1:G) Q4.5(TR2:G)
N$160: IC12.10(D:B) R51.1
N$161: R79.1 RV16.1(A)
N$162: Q16.1(TR1:B) R23.2 R27.1
OUTPUT_OFFSET: R53.1 ; also sheet 2,3,4,5
RESET_G: Q8.1(G) ; also sheet 1,2,3,4,5
SINE_SW: IC12.12(D:C) ; also sheet 1,3,4,5
SQ_-5V: Q4.3(TR2:D) ; also sheet 2,3,4,5
SQ_SW: IC12.6(C:C) ; also sheet 1,3,4,5
Unconnected: IC10.15(B:DIODE/BIAS) RV12.3(E) RV16.3(E)

### Notes on the sheet
- Title:
- Date:
- Sheet:
- (c) 2023 Expert Sleepers Ltd

## Library data of the parts
C1-C33 = rcl:C-EU: CAPACITOR, European symbol
D1 D2 = rohm2:RB060M-60: Schottky Barrier Diode
D3-D6 = diodes:BAW56L
IC1-IC7 = digital-audio:TL074: OP AMP
IC8 = digital-audio:TL072
IC9 IC10 = texas:LM13700: Dual Operational Transconductance Amplifiers with Linearizing Diodes and Buffers Source: lm13700.PDF
IC11 IC12 = texas:CD4066B: Quad bilateral ANALOG SWITCH
JP1 = headers:JP2E: JUMPER
Q1-Q4 Q25 = NXP:NX6020CAKS
Q5-Q8 = digital-audio:2N7002: 2N7002 N-channel MOSFET
Q9-Q12 = NXP:BC859W
Q13-Q16 = SamacSys_Parts:PMP4201Y: Bipolar Transistors - BJT MATCHED PAIR Source: Datasheet <https://componentsearchengine.com/Datasheets/1/PMP4201Y,135.pdf>; ARROW_PART_NUMBER: PMP4201Y,135; ARROW_PRICE-STOCK: https://www.arrow.com/en/products/pmp4201y135/nexperia; DESCRIPTION: Bipolar Transistors - BJT MATCHED PAIR; HEIGHT: 1.1mm; MANUFACTURER_NAME: Nexperia; MANUFACTURER_PART_NUMBER: PMP4201Y,135; MOUSER_PART_NUMBER: 771-PMP4201Y135; MOUSER_PRICE-STOCK: https://www.mouser.co.uk/ProductDetail/Nexperia/PMP4201Y135?qs=LOCUfHb8d9uqwNS3d98RHQ%3D%3D
Q17-Q20 = SamacSys_Parts:PMP5201Y: Bipolar Transistors - BJT MATCHED PAIR Source: Datasheet <https://eu.mouser.com/datasheet/2/268/40001414E-1066494.pdf>; ARROW_PART_NUMBER: PMP5201Y,135; ARROW_PRICE-STOCK: https://www.arrow.com/en/products/pmp5201y135/nexperia; DESCRIPTION: Bipolar Transistors - BJT MATCHED PAIR; HEIGHT: 1.1mm; MANUFACTURER_NAME: Nexperia; MANUFACTURER_PART_NUMBER: PMP5201Y,135; MOUSER_PART_NUMBER: 771-PMP5201Y135; MOUSER_PRICE-STOCK: https://www.mouser.co.uk/ProductDetail/Nexperia/PMP5201Y135?qs=LOCUfHb8d9vvvsx1DGNhtA%3D%3D
Q21-Q24 = transistor-small-signal:MMBFJ3*: N-Channel RF Amplifier Source: http://www.fairchildsemi.com/pf/J3/J310.html
R1-R92 = rcl:R-EU_: RESISTOR, European symbol
RV1-RV4 = soundwell:RD1610NOA0X: 16mm Potentiometer one level Source: http://www.alphapotentiometers.net/html/16mm_pot_2.html
RV5-RV16 = bourns:TC33X
SV1 = digital-audio:ML16: MULTICOMP - MC9A12-1634
SW1 SW2 = switch-multicomp:2MS3*M7
TP1-TP5 = testpad:TP: Test pad
X1 = con-samtec:TSW-107-02-S-D: THROUGH-HOLE .025" SQ POST HEADER Source: Samtec TSW.pdf; OC_FARNELL: unknown; OC_NEWARK: unknown